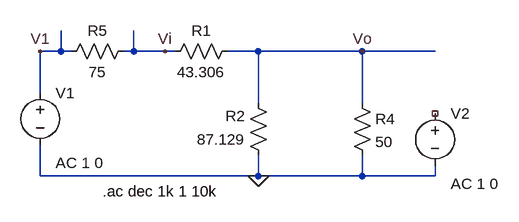
[diagram p0: schematic circuito_P2.asc]
circuito_P2.asc, the LTspice schematic file:
Version 4
SHEET 1 880 680
WIRE -80 32 -80 0
WIRE -80 32 -112 32
WIRE -64 32 -80 32
WIRE 32 32 32 0
WIRE 32 32 16 32
WIRE 80 32 32 32
WIRE 96 32 80 32
WIRE 224 32 176 32
WIRE 384 32 224 32
WIRE 496 32 384 32
WIRE -112 96 -112 32
WIRE 224 112 224 32
WIRE 384 112 384 32
WIRE -112 224 -112 176
WIRE 224 224 224 192
WIRE 224 224 -112 224
WIRE 384 224 384 192
WIRE 384 224 224 224
WIRE 496 224 496 208
WIRE 496 224 384 224
FLAG 224 224 0
FLAG 384 32 Vo
FLAG -112 32 V1
FLAG 80 32 Vi
SYMBOL voltage -112 80 R0
WINDOW 123 24 124 Left 2
WINDOW 39 0 0 Left 0
SYMATTR Value2 AC 1 0
SYMATTR InstName V1
SYMATTR Value ""
SYMBOL res 192 16 R90
WINDOW 0 0 56 VBottom 2
WINDOW 3 32 56 VTop 2
SYMATTR InstName R1
SYMATTR Value 43.306
SYMBOL res 240 208 R180
WINDOW 0 36 76 Left 2
WINDOW 3 36 40 Left 2
SYMATTR InstName R2
SYMATTR Value 87.129
SYMBOL res 368 96 R0
SYMATTR InstName R4
SYMATTR Value 50
SYMBOL res -80 48 R270
WINDOW 0 32 56 VTop 2
WINDOW 3 0 56 VBottom 2
SYMATTR InstName R5
SYMATTR Value 75
SYMBOL voltage 496 112 R0
WINDOW 123 24 124 Left 2
WINDOW 39 0 0 Left 0
SYMATTR Value2 AC 1 0
SYMATTR InstName V2
SYMATTR Value ""
TEXT -16 248 Left 2 !.ac dec 1k 1 10k

The netlist it stands for:
* circuito_P2.asc
V1 V1 0 AC 1 0
R1 Vo Vi 43.306
R2 0 Vo 87.129
R4 Vo 0 50
R5 V1 Vi 75
V2 NC_01 0 AC 1 0
.ac dec 1k 1 10k
.backanno
.end